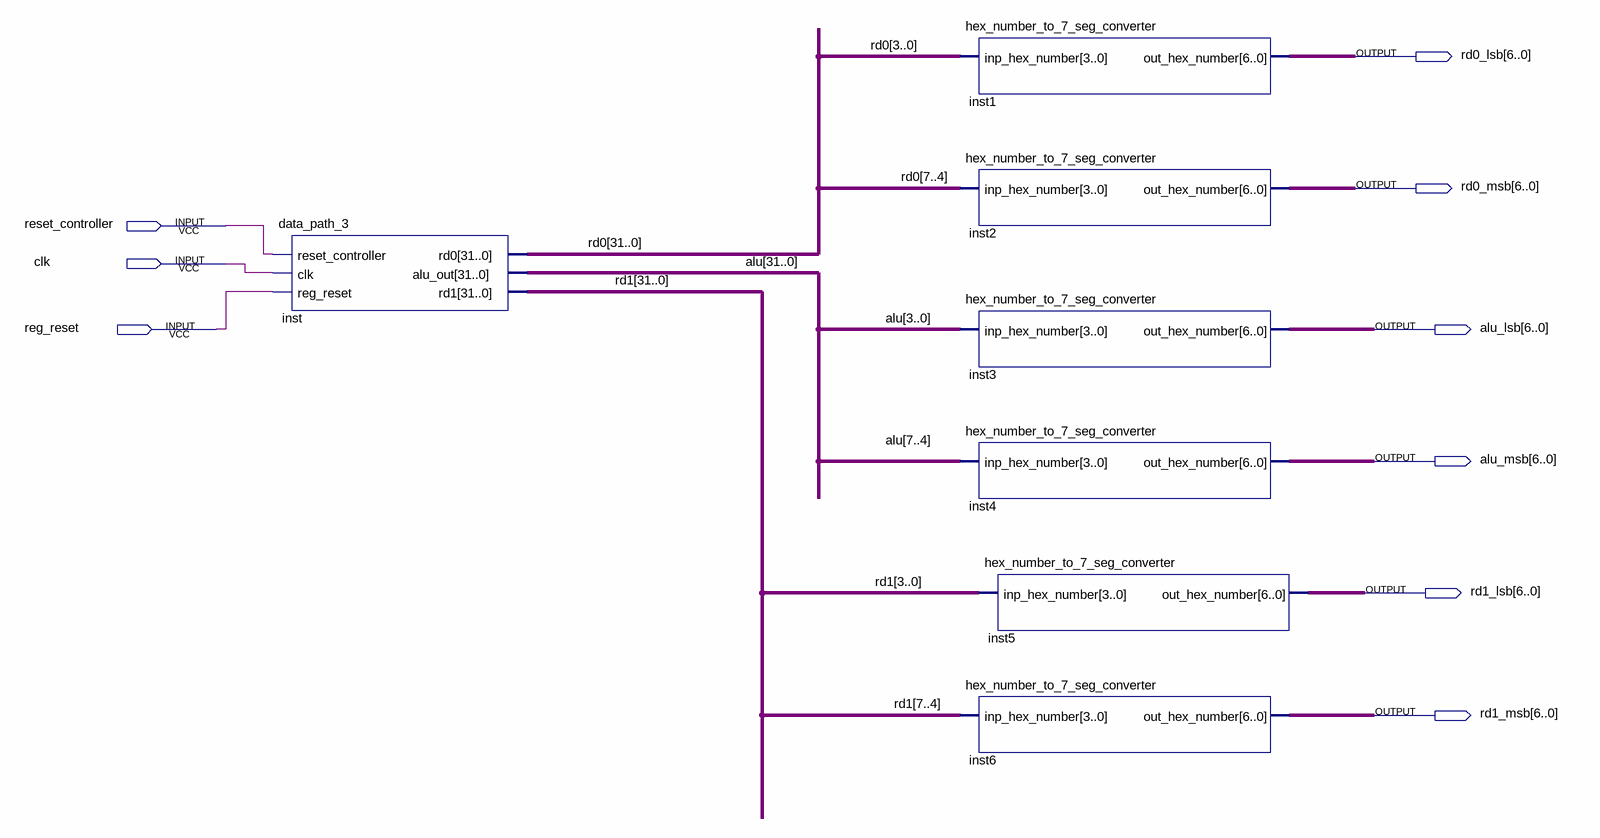
[diagram p0: schematic sheet]
// Quartus schematic data_path_top.bdf as structural Verilog: 7 symbols, 9 pins
module data_path_top (
  input  reset_controller,
  input  clk,
  input  reg_reset,
  output [6:0] rd0_lsb,
  output [6:0] rd0_msb,
  output [6:0] alu_lsb,
  output [6:0] alu_msb,
  output [6:0] rd1_lsb,
  output [6:0] rd1_msb
);

  wire [31:0] alu, rd0, rd1;

  data_path_3 inst (
    .reset_controller(reset_controller), .clk(clk), .reg_reset(reg_reset), .rd0(rd0), .alu_out(alu), .rd1(rd1));
  hex_number_to_7_seg_converter inst1 (.inp_hex_number(rd0[3:0]), .out_hex_number(rd0_lsb));
  hex_number_to_7_seg_converter inst2 (.inp_hex_number(rd0[7:4]), .out_hex_number(rd0_msb));
  hex_number_to_7_seg_converter inst3 (.inp_hex_number(alu[3:0]), .out_hex_number(alu_lsb));
  hex_number_to_7_seg_converter inst4 (.inp_hex_number(alu[7:4]), .out_hex_number(alu_msb));
  hex_number_to_7_seg_converter inst5 (.inp_hex_number(rd1[3:0]), .out_hex_number(rd1_lsb));
  hex_number_to_7_seg_converter inst6 (.inp_hex_number(rd1[7:4]), .out_hex_number(rd1_msb));
endmodule
